# Altium schematic sheet Zynq Power.SchDoc
size Tabloid; ApprovedBy: NA
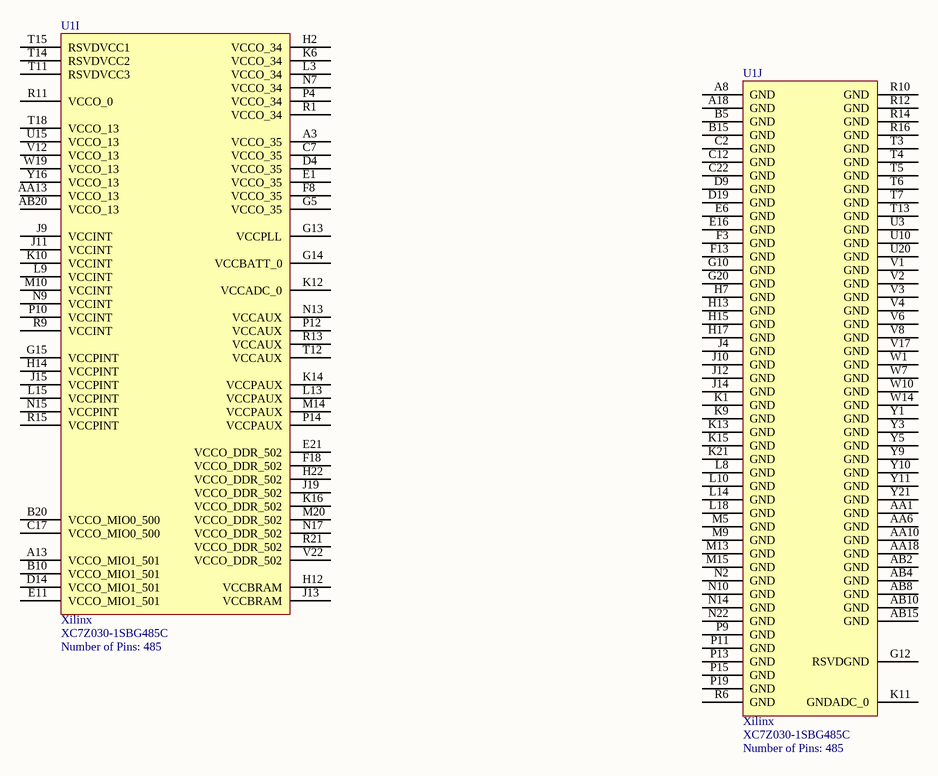
[diagram p0: Zynq Power.SchDoc]

## Parts
U1  Manufacturer: Xilinx  Manufacturer Part Number: XC7Z030-1SBG485C  Number of Pins: 485  [SBG484]  (hidden comment: U_XNLX-XC7Z030-1SBG485C)  (parts I,J of 10)

## Nets

Not connected (* = marked no-connect by the designer): U1 A3(VCCO_35) A8(GND) A13(VCCO_MIO1_501) A18(GND) AA1(GND) AA6(GND) AA10(GND) AA13(VCCO_13) AA18(GND) AB2(GND) AB4(GND) AB8(GND) AB10(GND) AB15(GND) AB20(VCCO_13) B5(GND) B10(VCCO_MIO1_501) B15(GND) B20(VCCO_MIO0_500) C2(GND) C7(VCCO_35) C12(GND) C17(VCCO_MIO0_500) C22(GND) D4(VCCO_35) D9(GND) D14(VCCO_MIO1_501) D19(GND) E1(VCCO_35) E6(GND) E11(VCCO_MIO1_501) E16(GND) E21(VCCO_DDR_502) F3(GND) F8(VCCO_35) F13(GND) F18(VCCO_DDR_502) G5(VCCO_35) G10(GND) G12(RSVDGND) G13(VCCPLL) G14(VCCBATT_0) G15(VCCPINT) G20(GND) H2(VCCO_34) H7(GND) H12(VCCBRAM) H13(GND) H14(VCCPINT) H15(GND) H17(GND) H22(VCCO_DDR_502) J4(GND) J9(VCCINT) J10(GND) J11(VCCINT) J12(GND) J13(VCCBRAM) J14(GND) J15(VCCPINT) J19(VCCO_DDR_502) K1(GND) K6(VCCO_34) K9(GND) K10(VCCINT) K11(GNDADC_0) K12(VCCADC_0) K13(GND) K14(VCCPAUX) K15(GND) K16(VCCO_DDR_502) K21(GND) L3(VCCO_34) L8(GND) L9(VCCINT) L10(GND) L13(VCCPAUX) L14(GND) L15(VCCPINT) L18(GND) M5(GND) M9(GND) M10(VCCINT) M13(GND) M14(VCCPAUX) M15(GND) M20(VCCO_DDR_502) N2(GND) N7(VCCO_34) N9(VCCINT) N10(GND) N13(VCCAUX) N14(GND) N15(VCCPINT) N17(VCCO_DDR_502) N22(GND) P4(VCCO_34) P9(GND) P10(VCCINT) P11(GND) P12(VCCAUX) P13(GND) P14(VCCPAUX) P15(GND) P19(GND) R1(VCCO_34) R6(GND) R9(VCCINT) R10(GND) R11(VCCO_0) R12(GND) R13(VCCAUX) R14(GND) R15(VCCPINT) R16(GND) R21(VCCO_DDR_502) T3(GND) T4(GND) T5(GND) T6(GND) T7(GND) T11(RSVDVCC3) T12(VCCAUX) T13(GND) T14(RSVDVCC2) T15(RSVDVCC1) T18(VCCO_13) U3(GND) U10(GND) U15(VCCO_13) U20(GND) V1(GND) V2(GND) V3(GND) V4(GND) V6(GND) V8(GND) V12(VCCO_13) V17(GND) V22(VCCO_DDR_502) W1(GND) W7(GND) W10(GND) W14(GND) W19(VCCO_13) Y1(GND) Y3(GND) Y5(GND) Y9(GND) Y10(GND) Y11(GND) Y16(VCCO_13) Y21(GND)

## Notes on the sheet
- Project:
- http://www.cospandesign.com
- Cospan Design
- Document:
- Engineer:
- Title:
- Client:
- Approved By:
- Revision:
- Date:
- Number:
- of

## Library data of the parts
U1 = U_XNLX-XC7Z030-1SBG485C: MPU Zynq-7000 RISC 32-Bit 667MHz 1.5V/2V/2.5V 485-Pin FBGA; Speed Grade: -1; RAM Size: 256KB; Number of I/Os: 130; Interface: I2C,SPI,USB,CAN,Ethernet,MMC,SDIO,SD,UART,USART,EBI/EMI; Data Bus Width: 32b; Peripherals: DMA; Supplier 1: Digikey; Stock 1: 102; Pricing 1: 1=230.1 (USD); Case/Package: FBGA; Contact Plating: Copper,Tin,Silver; Min Operating Temperature: 0°C; Max Operating Temperature: 85°C; Packaging: Tray; Frequency: 667MHz; Max Frequency: 667MHz; ComponentLink1URL: https://datasheet.ciiva.com/48476/ds190-zynq-7000-overview-48476904.pdf; ComponentLink1Description: https://datasheet.ciiva.com/48476/ds190-zynq-7000-overview-48476904.pdf; Supplier Part Number 1: 122-1924-ND